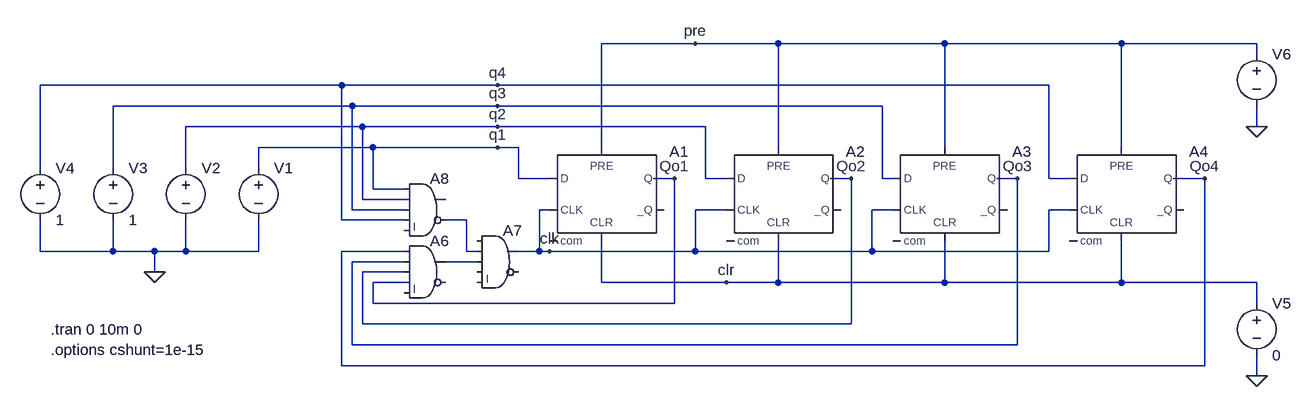
[diagram p0: schematic trigger-indicator.asc]
trigger-indicator.asc, the LTspice schematic file:
Version 4
SHEET 1 1064 680
WIRE -144 -176 -288 -176
WIRE -16 -176 -144 -176
WIRE 240 -176 -16 -176
WIRE 512 -176 240 -176
WIRE 720 -176 512 -176
WIRE 720 -160 720 -176
WIRE -688 -112 -1152 -112
WIRE -448 -112 -688 -112
WIRE 400 -112 -448 -112
WIRE -672 -80 -1040 -80
WIRE -448 -80 -672 -80
WIRE 144 -80 -448 -80
WIRE -656 -48 -928 -48
WIRE -448 -48 -656 -48
WIRE -128 -48 -448 -48
WIRE 720 -48 720 -80
WIRE -640 -16 -816 -16
WIRE -448 -16 -640 -16
WIRE -416 -16 -448 -16
WIRE -288 -16 -288 -176
WIRE -16 -16 -16 -176
WIRE 240 -16 240 -176
WIRE 512 -16 512 -176
WIRE -1152 16 -1152 -112
WIRE -1040 16 -1040 -80
WIRE -928 16 -928 -48
WIRE -816 16 -816 -16
WIRE -416 32 -416 -16
WIRE -368 32 -416 32
WIRE -176 32 -208 32
WIRE -128 32 -128 -48
WIRE -96 32 -128 32
WIRE 96 32 64 32
WIRE 144 32 144 -80
WIRE 160 32 144 32
WIRE 352 32 320 32
WIRE 400 32 400 -112
WIRE 432 32 400 32
WIRE 640 32 592 32
WIRE -640 48 -640 -16
WIRE -592 48 -640 48
WIRE -656 64 -656 -48
WIRE -592 64 -656 64
WIRE -672 80 -672 -80
WIRE -592 80 -672 80
WIRE -368 80 -384 80
WIRE -96 80 -144 80
WIRE 160 80 128 80
WIRE 432 80 400 80
WIRE -688 96 -688 -112
WIRE -592 96 -688 96
WIRE -496 96 -528 96
WIRE -1152 144 -1152 96
WIRE -1040 144 -1040 96
WIRE -1040 144 -1152 144
WIRE -976 144 -1040 144
WIRE -928 144 -928 96
WIRE -928 144 -976 144
WIRE -816 144 -816 96
WIRE -816 144 -928 144
WIRE -592 144 -688 144
WIRE -496 144 -496 96
WIRE -480 144 -496 144
WIRE -384 144 -384 80
WIRE -384 144 -416 144
WIRE -368 144 -384 144
WIRE -144 144 -144 80
WIRE -144 144 -368 144
WIRE 128 144 128 80
WIRE 128 144 -144 144
WIRE 400 144 400 80
WIRE 400 144 128 144
WIRE -592 160 -672 160
WIRE -480 160 -528 160
WIRE -976 176 -976 144
WIRE -592 176 -656 176
WIRE -592 192 -640 192
WIRE -288 192 -288 128
WIRE -96 192 -288 192
WIRE -16 192 -16 128
WIRE -16 192 -96 192
WIRE 240 192 240 128
WIRE 240 192 -16 192
WIRE 512 192 512 128
WIRE 512 192 240 192
WIRE 720 192 512 192
WIRE -640 224 -640 192
WIRE -176 224 -176 32
WIRE -176 224 -640 224
WIRE 720 224 720 192
WIRE -656 256 -656 176
WIRE 96 256 96 32
WIRE 96 256 -656 256
WIRE -672 288 -672 160
WIRE 352 288 352 32
WIRE 352 288 -672 288
WIRE -688 320 -688 144
WIRE 640 320 640 32
WIRE 640 320 -688 320
WIRE 720 336 720 304
FLAG 720 336 0
FLAG -976 176 0
FLAG -448 -16 q1
FLAG -96 192 clr
FLAG -176 32 Qo1
FLAG -368 144 clk
FLAG 96 32 Qo2
FLAG -448 -48 q2
FLAG -144 -176 pre
FLAG 720 -48 0
FLAG 352 32 Qo3
FLAG 640 32 Qo4
FLAG -448 -80 q3
FLAG -448 -112 q4
SYMBOL Digital\\dflop -288 -16 R0
SYMATTR InstName A1
SYMATTR Value2 Vhigh=1 Vlow=0
SYMATTR SpiceLine Trise=1u Tfall=1u Td=1u
SYMBOL Digital\\dflop -16 -16 R0
SYMATTR InstName A2
SYMATTR Value2 Vhigh=1 Vlow=0
SYMATTR SpiceLine Trise=1u Tfall=1u Td=1u
SYMBOL Digital\\dflop 240 -16 R0
SYMATTR InstName A3
SYMBOL Digital\\dflop 512 -16 R0
SYMATTR InstName A4
SYMBOL Digital\\and -448 96 R0
SYMATTR InstName A7
SYMBOL voltage -816 0 R0
WINDOW 3 -329 298 Invisible 2
WINDOW 123 0 0 Left 0
WINDOW 39 0 0 Left 0
SYMATTR Value PULSE(1 0 1m 100n 100n 1m 2m 2)
SYMATTR InstName V1
SYMBOL voltage -928 0 R0
WINDOW 3 -217 332 Invisible 2
WINDOW 123 0 0 Left 0
WINDOW 39 0 0 Left 0
SYMATTR Value PULSE(1 0 1.5m 100n 100n 1m)
SYMATTR InstName V2
SYMBOL voltage -1040 0 R0
WINDOW 123 0 0 Left 0
WINDOW 39 0 0 Left 0
SYMATTR InstName V3
SYMATTR Value 1
SYMBOL voltage -1152 0 R0
WINDOW 123 0 0 Left 0
WINDOW 39 0 0 Left 0
SYMATTR InstName V4
SYMATTR Value 1
SYMBOL voltage 720 208 R0
WINDOW 123 0 0 Left 0
WINDOW 39 0 0 Left 0
SYMATTR InstName V5
SYMATTR Value 0
SYMBOL Digital\\and -560 16 R0
SYMATTR InstName A8
SYMBOL voltage 720 -176 R0
WINDOW 123 0 0 Left 0
WINDOW 39 0 0 Left 0
WINDOW 3 24 96 Invisible 2
SYMATTR Value PULSE(0 1 0 100n 100n 200u)
SYMATTR InstName V6
SYMBOL Digital\\and -560 112 R0
SYMATTR InstName A6
TEXT -1136 264 Left 2 !.tran 0 10m 0
TEXT -1136 296 Left 2 !.options cshunt=1e-15

The netlist it stands for:
* trigger-indicator.asc
A1 q1 0 clk pre clr 0 Qo1 0 DFLOP Vhigh=1 Vlow=0 Trise=1u Tfall=1u Td=1u
A2 q2 0 clk pre clr 0 Qo2 0 DFLOP Vhigh=1 Vlow=0 Trise=1u Tfall=1u Td=1u
A3 q3 0 clk pre clr 0 Qo3 0 DFLOP
A4 q4 0 clk pre clr 0 Qo4 0 DFLOP
A7 0 N001 N002 0 0 0 clk 0 AND
V1 q1 0 PULSE(1 0 1m 100n 100n 1m 2m 2)
V2 q2 0 PULSE(1 0 1.5m 100n 100n 1m)
V3 q3 0 1
V4 q4 0 1
V5 clr 0 0
A8 q1 q2 q3 q4 0 N001 0 0 AND
V6 pre 0 PULSE(0 1 0 100n 100n 200u)
A6 Qo4 Qo3 Qo2 Qo1 0 0 N002 0 AND
.tran 0 10m 0
.options cshunt=1e-15
.backanno
.end